# EasyEDA Pro project Summer Robot.eprj, board PCB11
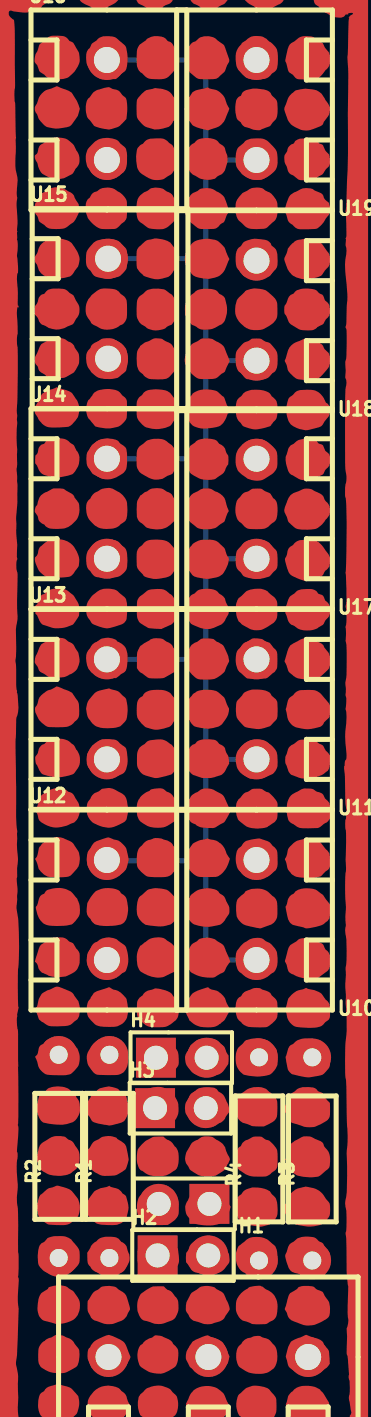
[diagram p18: board, top side]
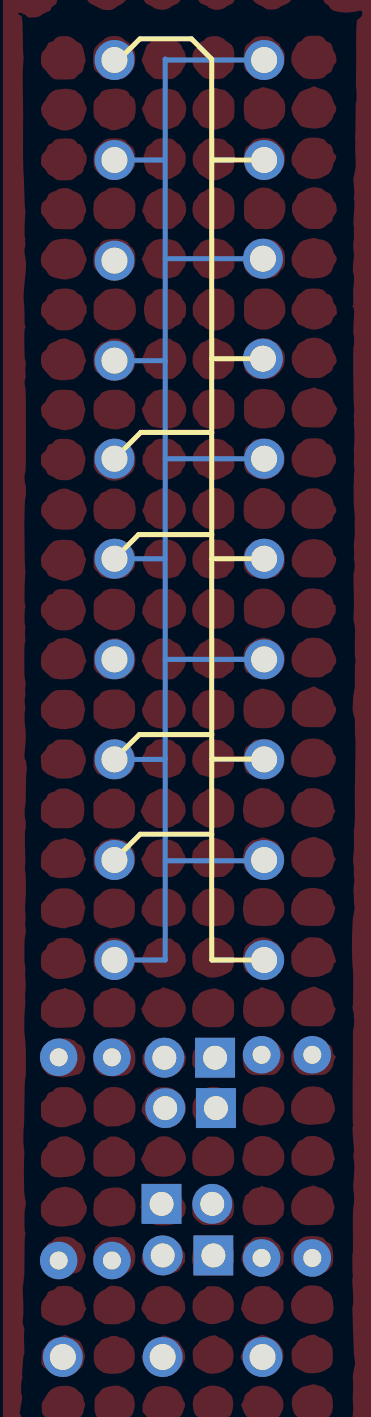
[diagram p19: board, bottom side, seen from below]

No outline. copper layers: Top Layer, Bottom Layer. Coordinates in mm from the lowest, leftmost part position.
Stack: Top Layer 0.035mm / Dielectric1 1.51mm FR4 er 4.5 / Bottom Layer 0.035mm

## Design rules (mm)
template: JLCPCB Capability(Two Layers Board)
spacing copperThickness1oz (default): track to track 0.102, other pairs 0.152 to 0.3
spacing copperThickness2oz: track to track 0.203, other pairs 0.152 to 0.3
track width copperThickness1oz (default): min 0.127, default 0.254, max 2.54
track width copperThickness2oz: min 0.203, default 0.254, max 2.54
differential pair differentialPair (default): width min 0.127, default 0.254, max 2.54; gap min 0.152, default 0.152
via viaSize (default): diameter min 0.5, default 0.61, max 10; hole min 0.3, default 0.305, max 6.3

## Placement (name value [footprint] x y rotation side)
H1  HX PH254-01-02-Z-L11.5 male header connector  [HDR-TH_2P-P2.54-V-M]  6.28 7.66 180 top
H2  HX PH254-01-02-Z-L11.5 male header connector  [HDR-TH_2P-P2.54-V-M]  6.22 5.08 0 top
H3  HX PH254-01-02-Z-L11.5 male header connector  [HDR-TH_2P-P2.54-V-M]  6.1 12.45 0 top
H4  HX PH254-01-02-Z-L11.5 male header connector  [HDR-TH_2P-P2.54-V-M]  6.14 14.96 0 top
P7  WJ126V-5.0-03P-14-00A  [CONN-TH_3P-P5.00_WJ126V-5.0-3P]  7.49 0 180 top
R1  4.7kΩ  [R_AXIAL-0.4]  2.54 10.03 90 top
R2  2.2kΩ  [R_AXIAL-0.4]  0 10.03 90 top
R3  4.7kΩ  [R_AXIAL-0.4]  12.7 9.91 90 top
R4  2.2kΩ  [R_AXIAL-0.4]  10.03 9.91 90 top
U10  WJ126V-5.0-2P-16-00A  [CONN-TH_WJ126V-5.0-2P]  9.91 22.35 180 top
U11  WJ126V-5.0-2P-16-00A  [CONN-TH_WJ126V-5.0-2P]  9.91 32.38 180 top
U12  WJ126V-5.0-2P-16-00A  [CONN-TH_WJ126V-5.0-2P]  2.41 22.35 0 top
U13  WJ126V-5.0-2P-16-00A  [CONN-TH_WJ126V-5.0-2P]  2.41 32.38 0 top
U14  WJ126V-5.0-2P-16-00A  [CONN-TH_WJ126V-5.0-2P]  2.41 42.42 0 top
U15  WJ126V-5.0-2P-16-00A  [CONN-TH_WJ126V-5.0-2P]  2.47 52.42 0 top
U16  WJ126V-5.0-2P-16-00A  [CONN-TH_WJ126V-5.0-2P]  2.41 62.36 0 top
U17  WJ126V-5.0-2P-16-00A  [CONN-TH_WJ126V-5.0-2P]  9.91 42.42 180 top
U18  WJ126V-5.0-2P-16-00A  [CONN-TH_WJ126V-5.0-2P]  9.91 52.32 180 top
U19  WJ126V-5.0-2P-16-00A  [CONN-TH_WJ126V-5.0-2P]  9.91 62.36 180 top

## Footprints (pads in the part's own frame, mm; a bottom-side part is the same pattern mirrored in y, then rotated)
CONN-TH_3P-P5.00_WJ126V-5.0-3P
  round 2 hole 1.3: 1(5,0) 2(-0.002,0) 3(-5,0)
CONN-TH_WJ126V-5.0-2P
  round 2 hole 1.3: 1(0,2.501) 2(0,-2.501)
HDR-TH_2P-P2.54-V-M
  rect 2x2 hole 1.2: 1(-1.27,0)
  round 2 hole 1.2: 2(1.27,0)
R_AXIAL-0.4
  round 1.879 hole 0.899: 1(-5.08,0) 2(5.08,0)

## Nets
As in the schematic.

## Routing (per net, layer and track width the routed paths; a pad name or vN(x,y) marks a point on that pad's centre or on a via; arc(x,y) is an arc through that point)
$1N2305: length 37.3
  Bottom Layer w0.254: U16.1 7.33,64.86 7.37,64.9 ; U14.1 7.37,44.92 ; U13.1 7.37,34.89 ; U12.1 2.45,24.82 7.37,24.82 ; U15.1 7.37,54.92 ; 7.37,49.78 7.41,49.82 U18.1 ; 9.82,19.85 7.37,19.85 ; U19.1 7.38,59.86 ; U17.1 7.4,39.92 ; U11.1 7.37,29.88

Small or netless copper shapes (teardrops, artwork), in the pictures only: 172 on Top Layer
